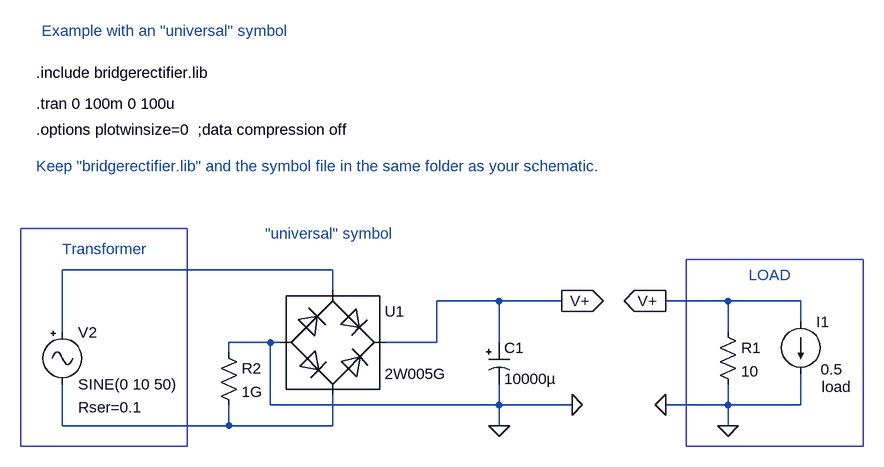
[diagram p0: schematic Bridge_Rectifier_test_u.asc]
Bridge_Rectifier_test_u.asc, the LTspice schematic file:
Version 4
SHEET 1 1036 680
WIRE -320 208 -320 112
WIRE -320 352 -320 288
WIRE -64 240 -64 224
WIRE -64 352 -320 352
WIRE -64 352 -64 320
WIRE 0 224 -64 224
WIRE 0 320 0 224
WIRE 16 224 0 224
WIRE 96 112 -320 112
WIRE 96 144 96 112
WIRE 96 352 -64 352
WIRE 96 352 96 304
WIRE 256 224 176 224
WIRE 256 224 256 160
WIRE 352 160 256 160
WIRE 352 224 352 160
WIRE 352 320 0 320
WIRE 352 320 352 288
WIRE 352 352 352 320
WIRE 448 160 352 160
WIRE 464 320 352 320
WIRE 704 160 608 160
WIRE 704 208 704 160
WIRE 704 320 608 320
WIRE 704 320 704 288
WIRE 704 352 704 320
WIRE 816 160 704 160
WIRE 816 192 816 160
WIRE 816 320 704 320
WIRE 816 320 816 272
FLAG 352 352 0
FLAG 448 160 V+
IOPIN 448 160 Out
FLAG 464 320 0
IOPIN 464 320 Out
FLAG 608 160 V+
IOPIN 608 160 Out
FLAG 608 320 0
IOPIN 608 320 Out
FLAG 704 352 0
SYMBOL Misc\\signal -320 192 R0
WINDOW 123 0 0 Left 0
WINDOW 39 24 132 Left 0
SYMATTR SpiceLine Rser=0.1
SYMATTR InstName V2
SYMATTR Value SINE(0 10 50)
SYMBOL polcap 336 224 R0
SYMATTR InstName C1
SYMATTR Value 10000µ
SYMATTR SpiceLine Rser=0.01
SYMBOL res 688 192 R0
SYMATTR InstName R1
SYMATTR Value 10
SYMBOL res -80 224 R0
SYMATTR InstName R2
SYMATTR Value 1G
SYMBOL current 816 192 R0
WINDOW 3 31 73 Left 0
WINDOW 123 0 0 Left 0
WINDOW 39 32 100 Left 0
SYMATTR Value 0.5
SYMATTR SpiceLine load
SYMATTR InstName I1
SYMBOL bridgerectifier_u 96 224 R0
SYMATTR InstName U1
TEXT -360 -144 Left 0 !.tran 0 100m 0 100u
TEXT -360 -104 Left 0 !.options plotwinsize=0  ;data compression off
TEXT -8 56 Left 0 ;"universal" symbol
TEXT -360 -192 Left 0 !.include bridgerectifier.lib
TEXT 736 120 Left 0 ;LOAD
TEXT -320 80 Left 0 ;Transformer
TEXT -352 -256 Left 0 ;Example with an "universal" symbol
TEXT -360 -48 Left 0 ;Keep "bridgerectifier.lib" and the symbol file in the same folder as your schematic.
RECTANGLE Normal 912 384 640 96
RECTANGLE Normal -128 384 -384 48

The netlist it stands for:
* Bridge_Rectifier_test_u.asc
V2 N001 N002 SINE(0 10 50) Rser=0.1
C1 V+ 0 10000µ Rser=0.01
R1 V+ 0 10
R2 0 N002 1G
I1 V+ 0 0.5 load
XU1 N001 N002 0 V+ 2W005G  ; pins Vin1 Vin2 V- V+
.tran 0 100m 0 100u
.options plotwinsize=0  ;data compression off
* "universal" symbol
.include bridgerectifier.lib
* LOAD
* Transformer
* Example with an "universal" symbol
* Keep "bridgerectifier.lib" and the symbol file in the same folder as your schematic.
.backanno
.end